# Altium schematic sheet msp_mcu.SchDoc
size A
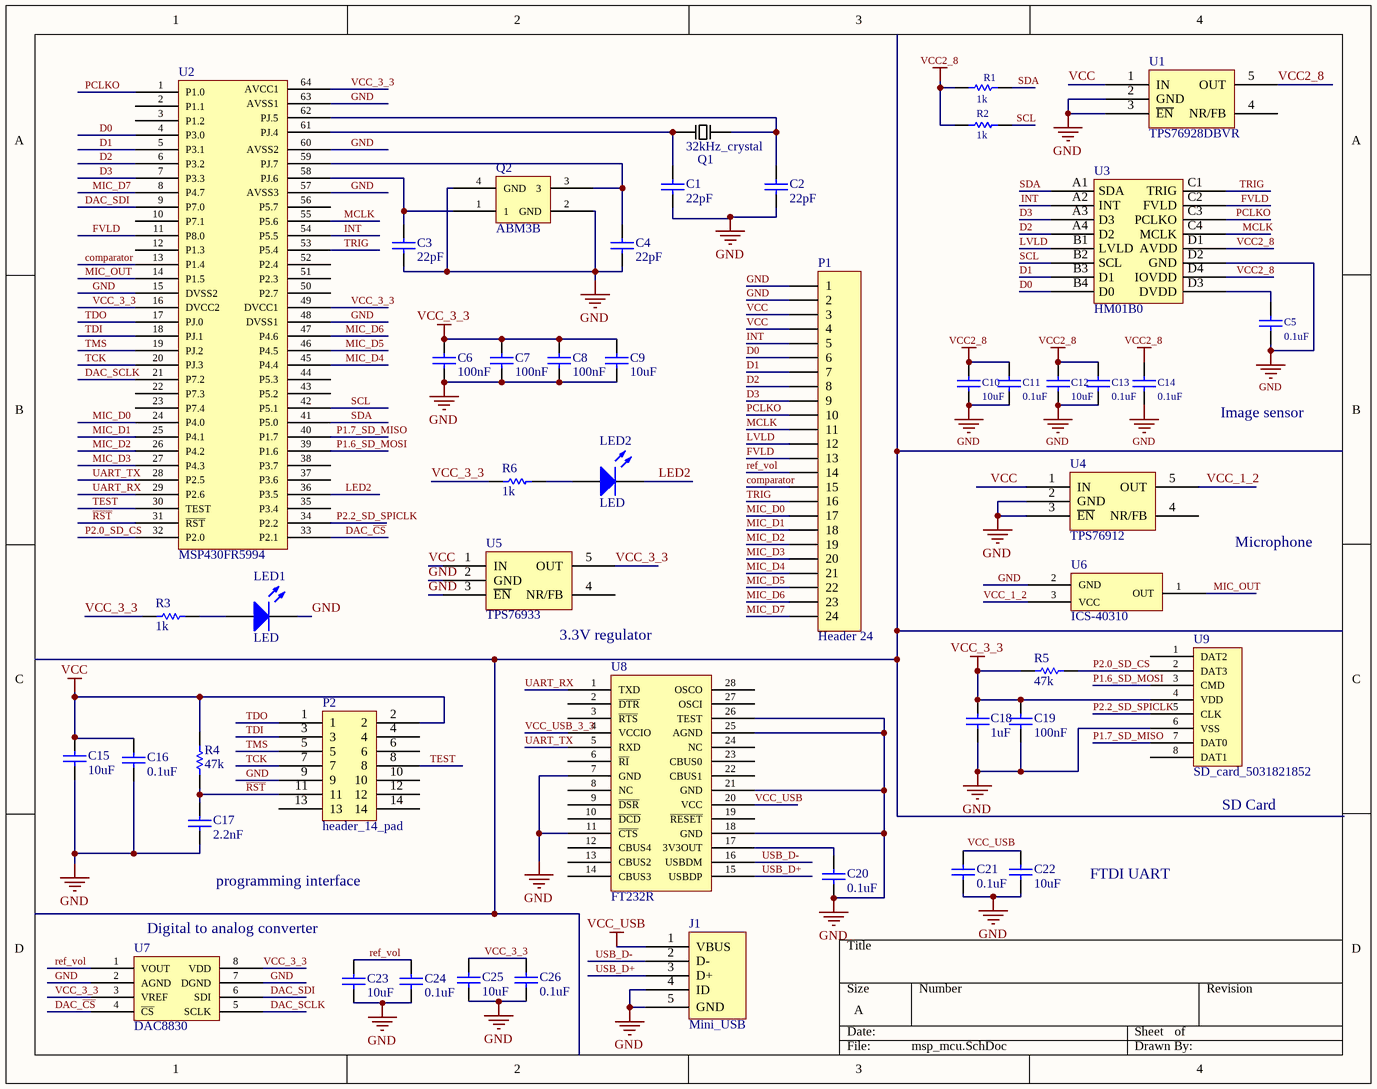
[diagram p0: msp_mcu.SchDoc]

## Parts
C1  value 22pF  [0603]  (hidden comment: Cap)
C2  value 22pF  [0603]  (hidden comment: Cap)
C3  value 22pF  [0603]  (hidden comment: Cap)
C4  value 22pF  [0603]  (hidden comment: Cap)
C5  value 0.1uF  [0603]  (hidden comment: Cap)
C6  value 100nF  [0603]  (hidden comment: Cap)
C7  value 100nF  [0603]  (hidden comment: Cap)
C8  value 100nF  [0603]  (hidden comment: Cap)
C9  value 10uF  [0603]  (hidden comment: Cap)
C10  value 10uF  [0603]  (hidden comment: Cap)
C11  value 0.1uF  [0603]  (hidden comment: Cap)
C12  value 10uF  [0603]  (hidden comment: Cap)
C13  value 0.1uF  [0603]  (hidden comment: Cap)
C14  value 0.1uF  [0603]  (hidden comment: Cap)
C15  value 10uF  [0603]  (hidden comment: Cap)
C16  value 0.1uF  [0603]  (hidden comment: Cap)
C17  value 2.2nF  [0603]  (hidden comment: Cap)
C18  value 1uF  [0603]  (hidden comment: Cap)
C19  value 100nF  [0603]  (hidden comment: Cap)
C20  value 0.1uF  [0603]  (hidden comment: Cap)
C21  value 0.1uF  [0603]  (hidden comment: Cap)
C22  value 10uF  [0603]  (hidden comment: Cap)
C23  value 10uF  [0603]  (hidden comment: Cap)
C24  value 0.1uF  [0603]  (hidden comment: Cap)
C25  value 10uF  [0603]  (hidden comment: Cap)
C26  value 0.1uF  [0603]  (hidden comment: Cap)
J1  Mini_USB  [Mini_USB]
LED1  LED  [0603]
LED2  LED  [0603]
P1  Header 24  [HDR1X24]
P2  header_14_pad  [header_14_pad]
Q1  32kHz_crystal  [32kHz_crystal]
Q2  ABM3B  [ABM3B]
R1  value 1k  [0603]  (hidden comment: Res)
R2  value 1k  [0603]  (hidden comment: Res)
R3  value 1k  [0603]  (hidden comment: Res)
R4  value 47k  [0603]  (hidden comment: Res)
R5  value 47k  [0603]  (hidden comment: Res)
R6  value 1k  [0603]  (hidden comment: Res)
U1  TPS76928DBVR  [TPS73633]
U2  MSP430FR5994  [MSP430FR5994]
U3  HM01B0  [HM01B0]
U4  TPS76912  [TPS73633]
U5  TPS76933  [TPS73633]
U6  ICS-40310  [ICS-40310]
U7  DAC8830  [DAC8830]
U8  FT232R  [FT232R]
U9  SD_card_5031821852  [SD_card_5031821852]

## Nets
GND: C1.1 C2.1 C3.1 C4.1 C5.1 C6.1 C7.1 C8.1 C9.1 C10.1 C11.1 C12.1 C13.1 C14.1 C15.1 C16.1 C17.1 C18.1 C19.1 C20.2 C21.1 C22.1 C23.1 C24.1 C25.1 C26.1 J1.4(ID) J1.5(GND) LED1.2(K) P1.1 P1.2 P2.9 Q2.2(GND) Q2.4(GND) U1.2(GND) U1.3(~{EN}) U2.15(DVSS2) U2.48(DVSS1) U2.57(AVSS3) U2.60(AVSS2) U2.63(AVSS1) U3.D2(GND) U4.2(GND) U4.3(~{EN}) U5.2(GND) U5.3(~{EN}) U6.2(GND) U7.2(AGND) U7.7(DGND) U8.7(GND) U8.11(~{CTS}) U8.18(GND) U8.21(GND) U8.25(AGND) U8.26(TEST) U9.6(VSS)
VCC: C15.2 C16.2 P1.3 P1.4 P2.2 R4.2 U1.1(IN) U4.1(IN) U5.1(IN)
VCC2_8: C10.2 C11.2 C12.2 C13.2 C14.2 R1.2 R2.2 U1.5(OUT) U3.D1(AVDD) U3.D4(IOVDD)
VCC_3_3: C6.2 C7.2 C8.2 C9.2 C18.2 C19.2 C25.2 C26.2 R3.2 R5.1 R6.2 U2.16(DVCC2) U2.49(DVCC1) U2.64(AVCC1) U5.5(OUT) U7.3(VREF) U7.8(VDD) U9.4(VDD)
VCC_USB: J1.1(VBUS) U8.20(VCC)
~{RST}: C17.2 P2.11 R4.1 U2.31(~{RST})
comparator: P1.15 U2.13(P1.4)
D0: P1.6 U2.4(P3.0) U3.B4(D0)
D1: P1.7 U2.5(P3.1) U3.B3(D1)
D2: P1.8 U2.6(P3.2) U3.A4(D2)
D3: P1.9 U2.7(P3.3) U3.A3(D3)
DAC_~{CS}: U2.33(P2.1) U7.4(~{CS})
DAC_SCLK: U2.21(P7.2) U7.5(SCLK)
DAC_SDI: U2.9(P7.0) U7.6(SDI)
FVLD: P1.13 U2.11(P8.0) U3.C2(FVLD)
INT: P1.5 U2.54(P5.5) U3.A2(INT)
LED2: LED2.2(K) U2.36(P3.5)
LVLD: P1.12 U3.B1(LVLD)
MCLK: P1.11 U2.55(P5.6) U3.C4(MCLK)
MIC_D0: P1.17 U2.24(P4.0)
MIC_D1: P1.18 U2.25(P4.1)
MIC_D2: P1.19 U2.26(P4.2)
MIC_D3: P1.20 U2.27(P4.3)
MIC_D4: P1.21 U2.45(P4.4)
MIC_D5: P1.22 U2.46(P4.5)
MIC_D6: P1.23 U2.47(P4.6)
MIC_D7: P1.24 U2.8(P4.7)
MIC_OUT: U2.14(P1.5) U6.1(OUT)
P1.6_SD_MOSI: U2.39(P1.6) U9.3(CMD)
P1.7_SD_MISO: U2.40(P1.7) U9.7(DAT0)
P2.0_SD_CS: R5.2 U2.32(P2.0) U9.2(DAT3)
P2.2_SD_SPICLK: U2.34(P2.2) U9.5(CLK)
PCLKO: P1.10 U2.1(P1.0) U3.C3(PCLKO)
ref_vol: C23.2 C24.2 P1.14 U7.1(VOUT)
SCL: R2.1 U2.42(P5.1) U3.B2(SCL)
SDA: R1.1 U2.41(P5.0) U3.A1(SDA)
TCK: P2.7 U2.20(PJ.3)
TDI: P2.3 U2.18(PJ.1)
TDO: P2.1 U2.17(PJ.0)
TEST: P2.8 U2.30(TEST)
TMS: P2.5 U2.19(PJ.2)
TRIG: P1.16 U2.53(P5.4) U3.C1(TRIG)
UART_RX: U2.29(P2.6) U8.1(TXD)
UART_TX: U2.28(P2.5) U8.5(RXD)
USB_D+: J1.3(D+) U8.15(USBDP)
USB_D-: J1.2(D-) U8.16(USBDM)
VCC_1_2: U4.5(OUT) U6.3(VCC)
VCC_USB_3_3: U8.4(VCCIO)
NetC1_2: C1.2 Q1.2 U2.61(PJ.4)
NetC2_2: C2.2 Q1.1 U2.62(PJ.5)
NetC3_2: C3.2 Q2.1 U2.58(PJ.6)
NetC4_2: C4.2 Q2.3 U2.59(PJ.7)
NetC5_2: C5.2 U3.D3(DVDD)
NetC20_1: C20.1 U8.17(3V3OUT)
NetC21_2: C21.2 C22.2
NetLED1_1: LED1.1(A) R3.1
NetLED2_1: LED2.1(A) R6.1

Not connected (* = marked no-connect by the designer): P2 4 6 10 12 13 14; U1 4(NR/FB); U2 2(P1.1) 3(P1.2) 10(P7.1) 12(P1.3) 22(P7.3) 23(P7.4) 35(P3.4) 37(P3.6) 38(P3.7) 43(P5.2) 44(P5.3) 50(P2.7) 51(P2.3) 52(P2.4) 56(P5.7); U4 4(NR/FB); U5 4(NR/FB); U8 2(~{DTR}) 3(~{RTS}) 6(~{RI}) 8(NC) 9(~{DSR}) 10(~{DCD}) 12(CBUS4) 13(CBUS2) 14(CBUS3) 19(~{RESET}) 22(CBUS1) 23(CBUS0) 24(NC) 27(OSCI) 28(OSCO); U9 1(DAT2) 8(DAT1)

## Notes on the sheet
- Image sensor
- Microphone
- 3.3V regulator
- (near U9) SD Card
- programming interface
- FTDI UART
- Digital to analog converter
- Labels drawn without touching a wire or pin: VCC_USB

## Library data of the parts
C1-C26 = Cap: Ceramic Capacitor (Surface Mount); Manufacturer: Generic Ceramic Chip Cap (TBD); Digi-Key Part Number: *; Manufacturer Part Number: *; Note: *; Rating: *
P1 = Header 24: Header, 24-Pin; LatestRevisionDate: 17-Jul-2002; LatestRevisionNote: Re-released for DXP Platform.; Publisher: Altium Limited
R1-R6 = Res: Chip Resistor (Surface Mount); Manufacturer: Generic Chip Res (TBD); Manufacturer Part Number: *; Digi-Key Part Number: *; Rating: *
U1 = TPS76928DBVR: TPS73633
U4 = TPS76912: TPS73633
U5 = TPS76933: TPS73633